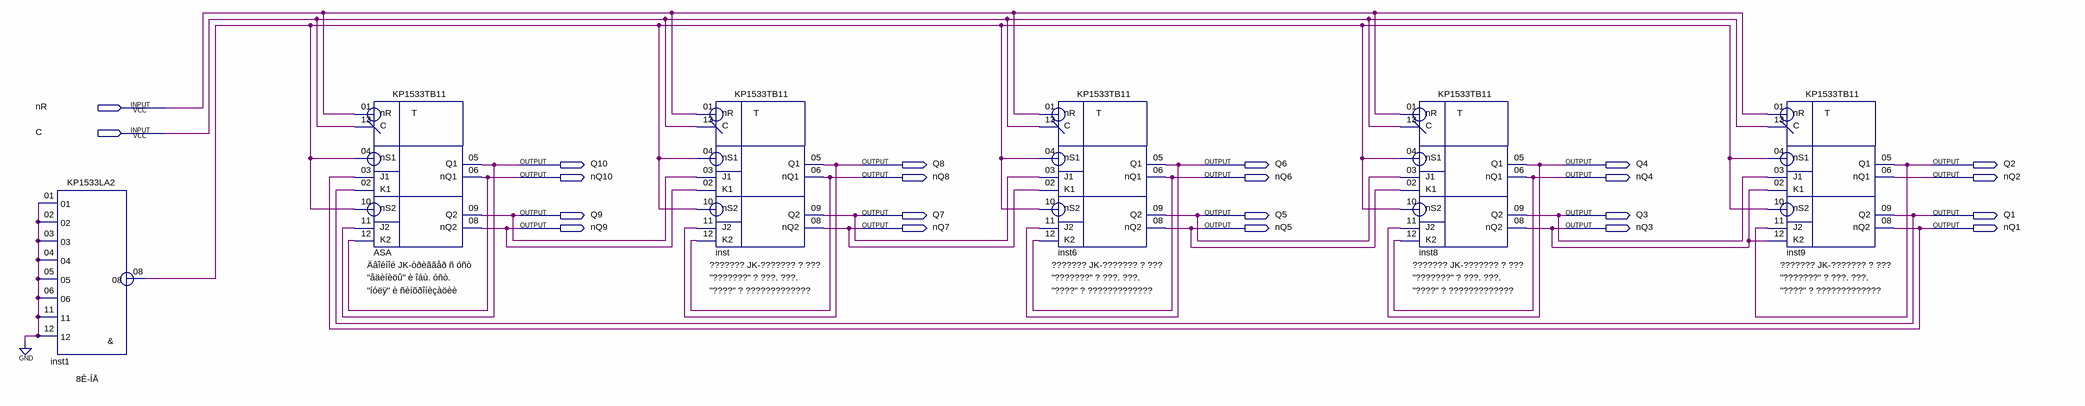
[diagram p0: schematic sheet]
// Quartus schematic Johnson_JK_Trig.bdf as structural Verilog: 6 symbols, 22 pins
module Johnson_JK_Trig (
  input  nR,
  input  C,
  output Q10,
  output Q8,
  output Q6,
  output Q4,
  output Q2,
  output nQ10,
  output nQ8,
  output nQ6,
  output nQ4,
  output nQ2,
  output Q9,
  output Q7,
  output Q5,
  output Q3,
  output Q1,
  output nQ9,
  output nQ7,
  output nQ5,
  output nQ3,
  output nQ1
);

  wire inst1_08;

  KP1533LA2 inst1 (
    .\01 (1'b0), .\02 (1'b0), .\03 (1'b0), .\04 (1'b0), .\05 (1'b0), .\06 (1'b0), .\11 (1'b0), .\12 (1'b0),
    .\08 (inst1_08));
  KP1533TB11 ASA (
    .nR(nR), .C(C), .nS1(inst1_08), .J1(nQ1), .K1(Q1), .nS2(inst1_08), .J2(Q10), .K2(nQ10), .Q1(Q10),
    .nQ1(nQ10), .Q2(Q9), .nQ2(nQ9));
  KP1533TB11 inst (
    .nR(nR), .C(C), .nS1(inst1_08), .J1(Q9), .K1(nQ9), .nS2(inst1_08), .J2(Q8), .K2(nQ8), .Q1(Q8), .nQ1(nQ8),
    .Q2(Q7), .nQ2(nQ7));
  KP1533TB11 inst6 (
    .nR(nR), .C(C), .nS1(inst1_08), .J1(Q7), .K1(nQ7), .nS2(inst1_08), .J2(Q6), .K2(nQ6), .Q1(Q6), .nQ1(nQ6),
    .Q2(Q5), .nQ2(nQ5));
  KP1533TB11 inst8 (
    .nR(nR), .C(C), .nS1(inst1_08), .J1(Q5), .K1(nQ5), .nS2(inst1_08), .J2(Q4), .K2(nQ4), .Q1(Q4), .nQ1(nQ4),
    .Q2(Q3), .nQ2(nQ3));
  KP1533TB11 inst9 (
    .nR(nR), .C(C), .nS1(inst1_08), .J1(Q3), .K1(nQ3), .nS2(inst1_08), .J2(Q2), .K2(nQ3), .Q1(Q2), .nQ1(nQ2),
    .Q2(Q1), .nQ2(nQ1));
endmodule
